# Altium schematic sheet miniPCIE Connector.SchDoc
size 420 x 297 mm; Author: ALTIUM GOSTBOM2.0 KEV; SheetNumber: 15; SheetTotal: 48
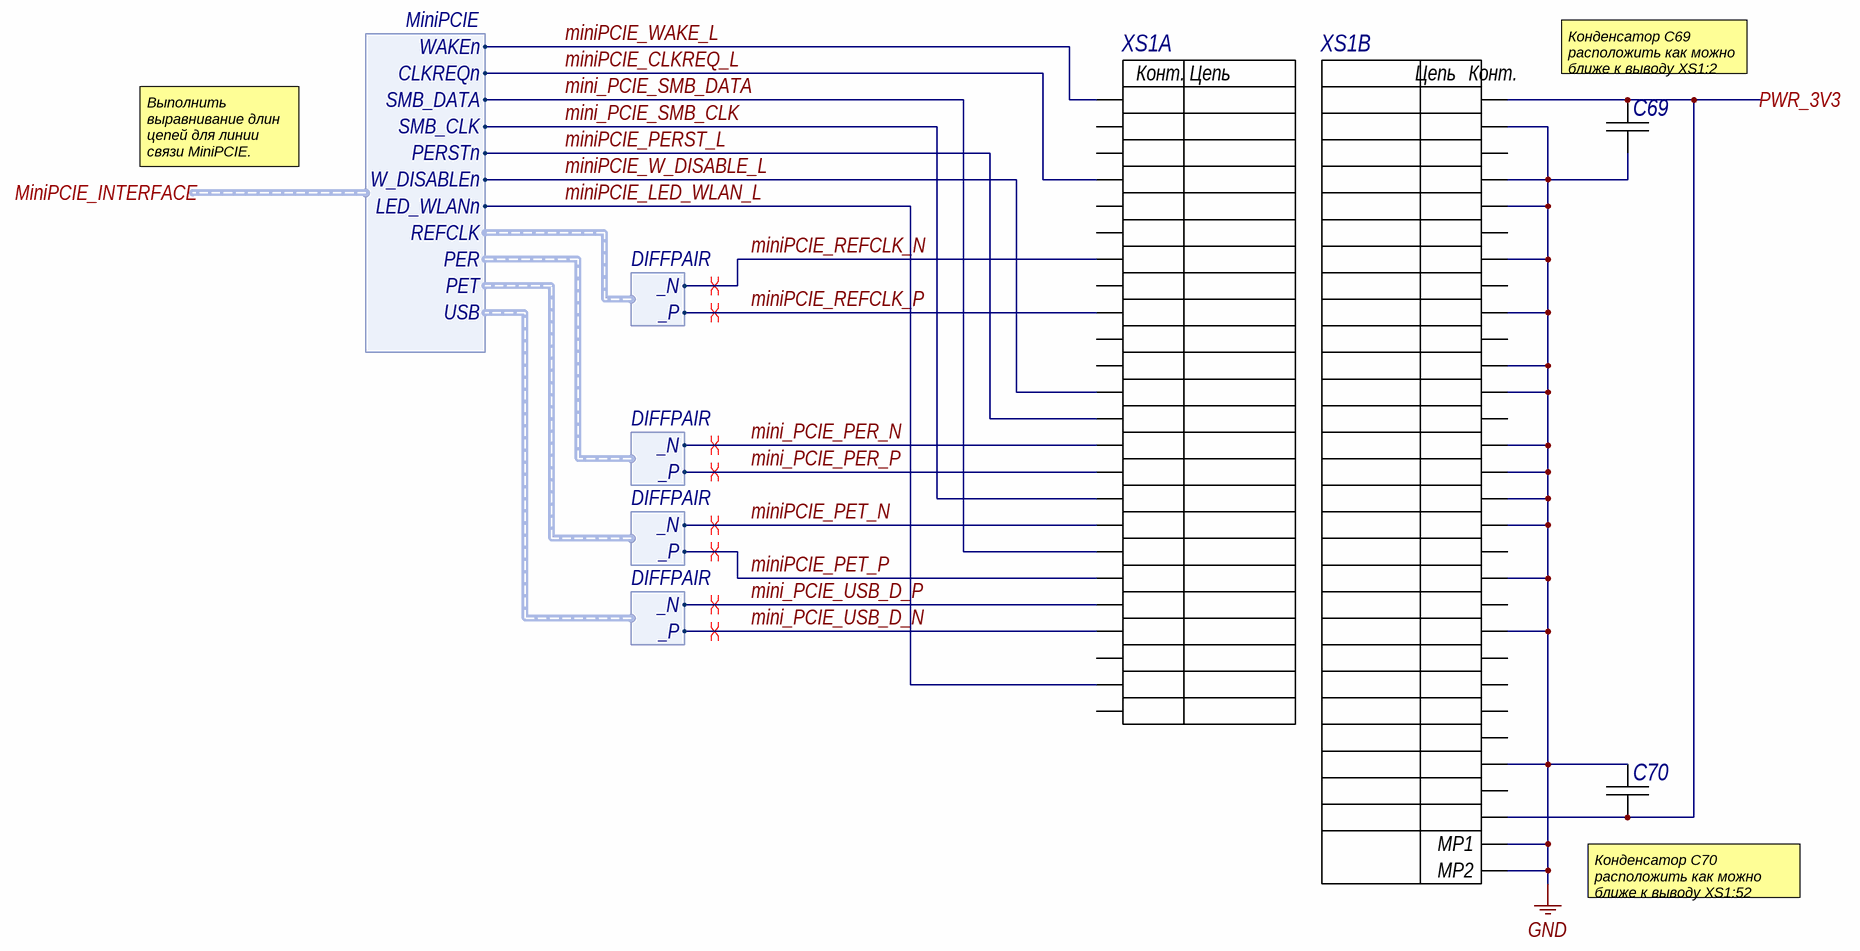
[diagram p0: miniPCIE Connector.SchDoc]

## Parts
C69  C1005X7R1E104M  [CAPC1005X55X10LL05]  (value not drawn)
C70  C1005X7R1E104M  [CAPC1005X55X10LL05]  (value not drawn)
XS1  292443-1  [BTB-SM0-8-2H52F]  (value not drawn)  (parts A,B of 2)

## Ports
MiniPCIE_INTERFACE (harness MiniPCIE), PWR_3V3

## Harnesses
DIFFPAIR: _P, _N
MiniPCIE: WAKEn, CLKREQn, SMB_DATA, SMB_CLK, PERSTn, W_DISABLEn, LED_WLANn, REFCLK, PER, PET, USB

## Nets
GND: C69.1 C70.2 XS1.4(GND) XS1.9(GND) XS1.15(GND) XS1.18(GND) XS1.21(GND) XS1.26(GND) XS1.27(GND) XS1.29(GND) XS1.34(GND) XS1.35(GND) XS1.37(GND) XS1.40(GND) XS1.43(GND) XS1.50(GND) XS1.MP1 XS1.MP2
mini_PCIE_PER_N: XS1.23(PERnO) ; harness DIFFPAIR._N
mini_PCIE_PER_P: XS1.25(PERpO) ; harness DIFFPAIR._P
mini_PCIE_SMB_CLK: XS1.30(SMB_CLK) ; port MiniPCIE_INTERFACE.SMB_CLK
mini_PCIE_SMB_DATA: XS1.32(SM8_DATA) ; port MiniPCIE_INTERFACE.SMB_DATA
mini_PCIE_USB_D_N: XS1.38(USB_D+) ; harness DIFFPAIR._P
mini_PCIE_USB_D_P: XS1.36(USB_D-) ; harness DIFFPAIR._N
miniPCIE_CLKREQ_L: XS1.7(CLKREQ#) ; port MiniPCIE_INTERFACE.CLKREQn
miniPCIE_LED_WLAN_L: XS1.44(LED_WLAN#) ; port MiniPCIE_INTERFACE.LED_WLANn
miniPCIE_PERST_L: XS1.22(PERST#) ; port MiniPCIE_INTERFACE.PERSTn
miniPCIE_PET_N: XS1.31(PETnO) ; harness DIFFPAIR._N
miniPCIE_PET_P: XS1.33(PETpO) ; harness DIFFPAIR._P
miniPCIE_REFCLK_N: XS1.11(REFCLK-) ; harness DIFFPAIR._N
miniPCIE_REFCLK_P: XS1.13(REFCLK_+) ; harness DIFFPAIR._P
miniPCIE_W_DISABLE_L: XS1.20(W.DISABLE#) ; port MiniPCIE_INTERFACE.W_DISABLEn
miniPCIE_WAKE_L: XS1.1(WAKE#) ; port MiniPCIE_INTERFACE.WAKEn
PWR_3V3: C69.2 C70.1 XS1.2(3,3Vaux) XS1.52(3,3Vaux) ; port PWR_3V3

Not connected (* = marked no-connect by the designer): XS1 3(COE_XI) 5(COEX2) 6(1,5V) 8(UIM.PWR) 10(UIM_DATA) 12(UIM_CLK) 14(UIM.RESET) 16(UIM_VPP) 17(Reserved) 19(Reserved) 24(3,3Vaux) 28(1,5V) 39(3,3Vaux) 41(3,3Vaux) 42(LED.WWAN#) 45(Reserved) 46(LED_WPAN#) 47(Reserved) 48(1,5V) 49(Reserved) 51(Reserved)

## Layout directives
differential pair: mini_PCIE_PER_N, mini_PCIE_PER_P, mini_PCIE_USB_D_N, mini_PCIE_USB_D_P, miniPCIE_PET_N, miniPCIE_PET_P, miniPCIE_REFCLK_N, miniPCIE_REFCLK_P

## Notes on the sheet
- (near C69) Конденсатор C69 расположить как можно ближе к выводу XS1:2
- Выполнить выравнивание длин цепей для линии связи MiniPCIE.
- (near C70) Конденсатор C70 расположить как можно ближе к выводу XS1:52
- Подп. дата
- Инв. № дубл.
- Взам. инв. №
- Подп. и дата
- Инв. № подл.
- Изм.
- Лист
- № докум.
- Подп.
- Дата
- ALTIUM GOSTBOM2.0 KEV
- Файл:
- Копировал
- Формат А3
- (in symbol E40, part A) Конт.; Цепь
- (in symbol E40, part B) Цепь; Конт.

## Library data of the parts
C69 = E11: Chip Capacitor, 0.1 uF, +/- 20%, 25 V, -55 to 125 degC, 0402 (1005 Metric), RoHS, Tape and Reel; Тип элемента: Конденсатор; Capacitance: 100 nF; Case\/Package: 0402; Type (Capacitors): X7R; Voltage Rating: 25 V; Old_des: C481; New_des: C69; UID: E11; Component Kind: Standard; Case Code (Imperial): 0402; Case Code (Metric): 1005; ComponentLink1Description: Manufacturer URL; ComponentLink1URL: http://www.tdk.com/; ComponentLink2Description: Datasheet; ComponentLink2URL: http://www.farnell.com/datasheets/1571323.pdf; DatasheetVersion: 09/2011; Length: 1 mm; Max Operating Temperature: 125 degC; Min Operating Temperature: -55 degC; Mounting Technology: Surface Mount; Package Quantity: 10000; PackageDescription: 2-Pin Surface Mount Device, Body 1 x 0.5 mm; Packaging: Tape and Reel; PartNumber: C1005X7R1E104M; RoHSCompliant: true; Tolerance: 20%; Width: 0.5 mm; Height: 0.5 mm; Mount: Surface Mount; PackageReference: 0402; Pins: 2; Voltage Rating (DC): 25 V
C70 = E11: Chip Capacitor, 0.1 uF, +/- 20%, 25 V, -55 to 125 degC, 0402 (1005 Metric), RoHS, Tape and Reel; Тип элемента: Конденсатор; Capacitance: 100 nF; Case\/Package: 0402; Type (Capacitors): X7R; Voltage Rating: 25 V; Old_des: C482; New_des: C70; UID: E11; Component Kind: Standard; Case Code (Imperial): 0402; Case Code (Metric): 1005; ComponentLink1Description: Manufacturer URL; ComponentLink1URL: http://www.tdk.com/; ComponentLink2Description: Datasheet; ComponentLink2URL: http://www.farnell.com/datasheets/1571323.pdf; DatasheetVersion: 09/2011; Length: 1 mm; Max Operating Temperature: 125 degC; Min Operating Temperature: -55 degC; Mounting Technology: Surface Mount; Package Quantity: 10000; PackageDescription: 2-Pin Surface Mount Device, Body 1 x 0.5 mm; Packaging: Tape and Reel; PartNumber: C1005X7R1E104M; RoHSCompliant: true; Tolerance: 20%; Width: 0.5 mm; Height: 0.5 mm; Mount: Surface Mount; PackageReference: 0402; Pins: 2; Voltage Rating (DC): 25 V
XS1 = E40: Board-to-Board Connector, SMT, Right Angle, Pitch 0.8mm, 52-Position, Female; Тип элемента: Соединитель; Mating Connector: PCIeMini-CN-2S-M-R52; Old_des: J13; New_des: XS1; UID: E40; Component Kind: Standard; ComponentLink1Description: Manufacturer URL; ComponentLink1URL: https://www.te.com/; ComponentLink2Description: Datasheet; ComponentLink2URL: https://www.te.com/commerce/DocumentDelivery/DDEController?Action=showdoc&DocId=Customer+Drawing%7F292443%7FC1%7Fpdf%7FEnglish%7FENG_CD_292443_C1.pdf%7F292443-1; System: Connector; ClassName: Board Template Connector; Datasheet Version: Oct-2006; Package Reference: BTB-SM0-8-2H52F; Publisher: Altium